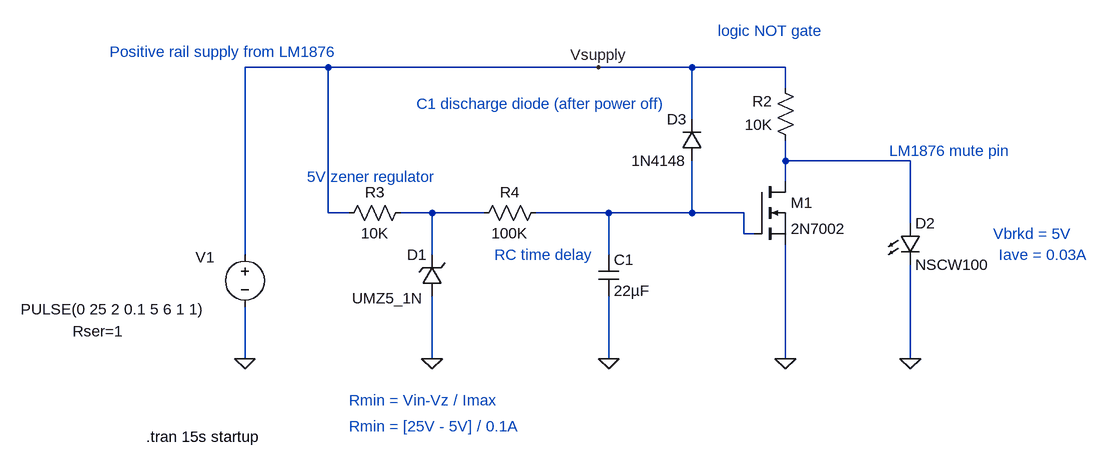
[diagram p0: schematic time_delayed_NOT_rev2.asc]
time_delayed_NOT_rev2.asc, the LTspice schematic file:
Version 4
SHEET 1 880 680
WIRE -448 -32 -576 -32
WIRE -32 -32 -448 -32
WIRE 112 -32 -32 -32
WIRE 256 -32 112 -32
WIRE 256 0 256 -32
WIRE 112 48 112 -32
WIRE 256 112 256 80
WIRE 448 112 256 112
WIRE 256 144 256 112
WIRE -448 192 -448 -32
WIRE -416 192 -448 192
WIRE -288 192 -336 192
WIRE -208 192 -288 192
WIRE -16 192 -128 192
WIRE 112 192 112 112
WIRE 112 192 -16 192
WIRE 192 192 112 192
WIRE 448 208 448 112
WIRE 192 224 192 192
WIRE 208 224 192 224
WIRE -576 256 -576 -32
WIRE -288 256 -288 192
WIRE -16 256 -16 192
WIRE -576 416 -576 336
WIRE -288 416 -288 320
WIRE -16 416 -16 320
WIRE 256 416 256 240
WIRE 448 416 448 272
FLAG 256 416 0
FLAG -576 416 0
FLAG -16 416 0
FLAG 448 416 0
FLAG -288 416 0
FLAG -32 -32 Vsupply
SYMBOL res 272 96 R180
WINDOW 0 36 76 Left 2
WINDOW 3 36 40 Left 2
SYMATTR InstName R2
SYMATTR Value 10K
SYMBOL voltage -576 240 R0
WINDOW 123 0 0 Left 0
WINDOW 39 -265 134 Left 2
WINDOW 0 -76 20 Left 2
WINDOW 3 -345 100 Left 2
SYMATTR SpiceLine Rser=1
SYMATTR InstName V1
SYMATTR Value PULSE(0 25 2 0.1 5 6 1 1)
SYMBOL zener -272 320 R180
WINDOW 0 24 64 Left 2
WINDOW 3 29 -3 Left 2
SYMATTR InstName D1
SYMATTR Value UMZ5_1N
SYMBOL cap -32 256 R0
SYMATTR InstName C1
SYMATTR Value 22µF
SYMBOL LED 432 208 R0
SYMATTR InstName D2
SYMATTR Value NSCW100
SYMBOL res -320 176 R90
WINDOW 0 0 56 VBottom 2
WINDOW 3 32 56 VTop 2
SYMATTR InstName R3
SYMATTR Value 10K
SYMBOL res -112 176 R90
WINDOW 0 0 56 VBottom 2
WINDOW 3 32 56 VTop 2
SYMATTR InstName R4
SYMATTR Value 100K
SYMBOL diode 128 112 R180
WINDOW 0 24 64 Left 2
WINDOW 3 24 0 Left 2
SYMATTR InstName D3
SYMATTR Value 1N4148
SYMBOL nmos 208 144 R0
SYMATTR InstName M1
SYMATTR Value 2N7002
TEXT 152 -88 Left 2 ;logic NOT gate
TEXT 416 96 Left 2 ;LM1876 mute pin
TEXT -480 136 Left 2 ;5V zener regulator
TEXT -784 -56 Left 2 ;Positive rail supply from LM1876
TEXT 576 224 Left 2 ;Vbrkd = 5V
TEXT 584 256 Left 2 ;Iave = 0.03A
TEXT -416 480 Left 2 ;Rmin = Vin-Vz / Imax
TEXT -416 520 Left 2 ;Rmin = [25V - 5V] / 0.1A
TEXT -192 256 Left 2 ;RC time delay
TEXT -728 536 Left 2 !.tran 15s startup
TEXT -312 24 Left 2 ;C1 discharge diode (after power off)

The netlist it stands for:
* time_delayed_NOT_rev2.asc
R2 N001 Vsupply 10K
V1 Vsupply 0 PULSE(0 25 2 0.1 5 6 1 1) Rser=1
D1 0 N002 UMZ5_1N
C1 N003 0 22µF
D2 N001 0 NSCW100
R3 N002 Vsupply 10K
R4 N003 N002 100K
D3 N003 Vsupply 1N4148
M1 N001 N003 0 0 2N7002
.model D D
.lib standard.dio
.model NMOS NMOS
.model PMOS PMOS
.lib standard.mos
* logic NOT gate
* LM1876 mute pin
* 5V zener regulator
* Positive rail supply from LM1876
* Vbrkd = 5V
* Iave = 0.03A
* Rmin = Vin-Vz / Imax
* Rmin = [25V - 5V] / 0.1A
* RC time delay
.tran 15s startup
* C1 discharge diode (after power off)
.backanno
.end